# EAGLE design ledtiny85-nrf-sot23 (EAGLE 8.3.2)
DESIGNER: Willie Zhu
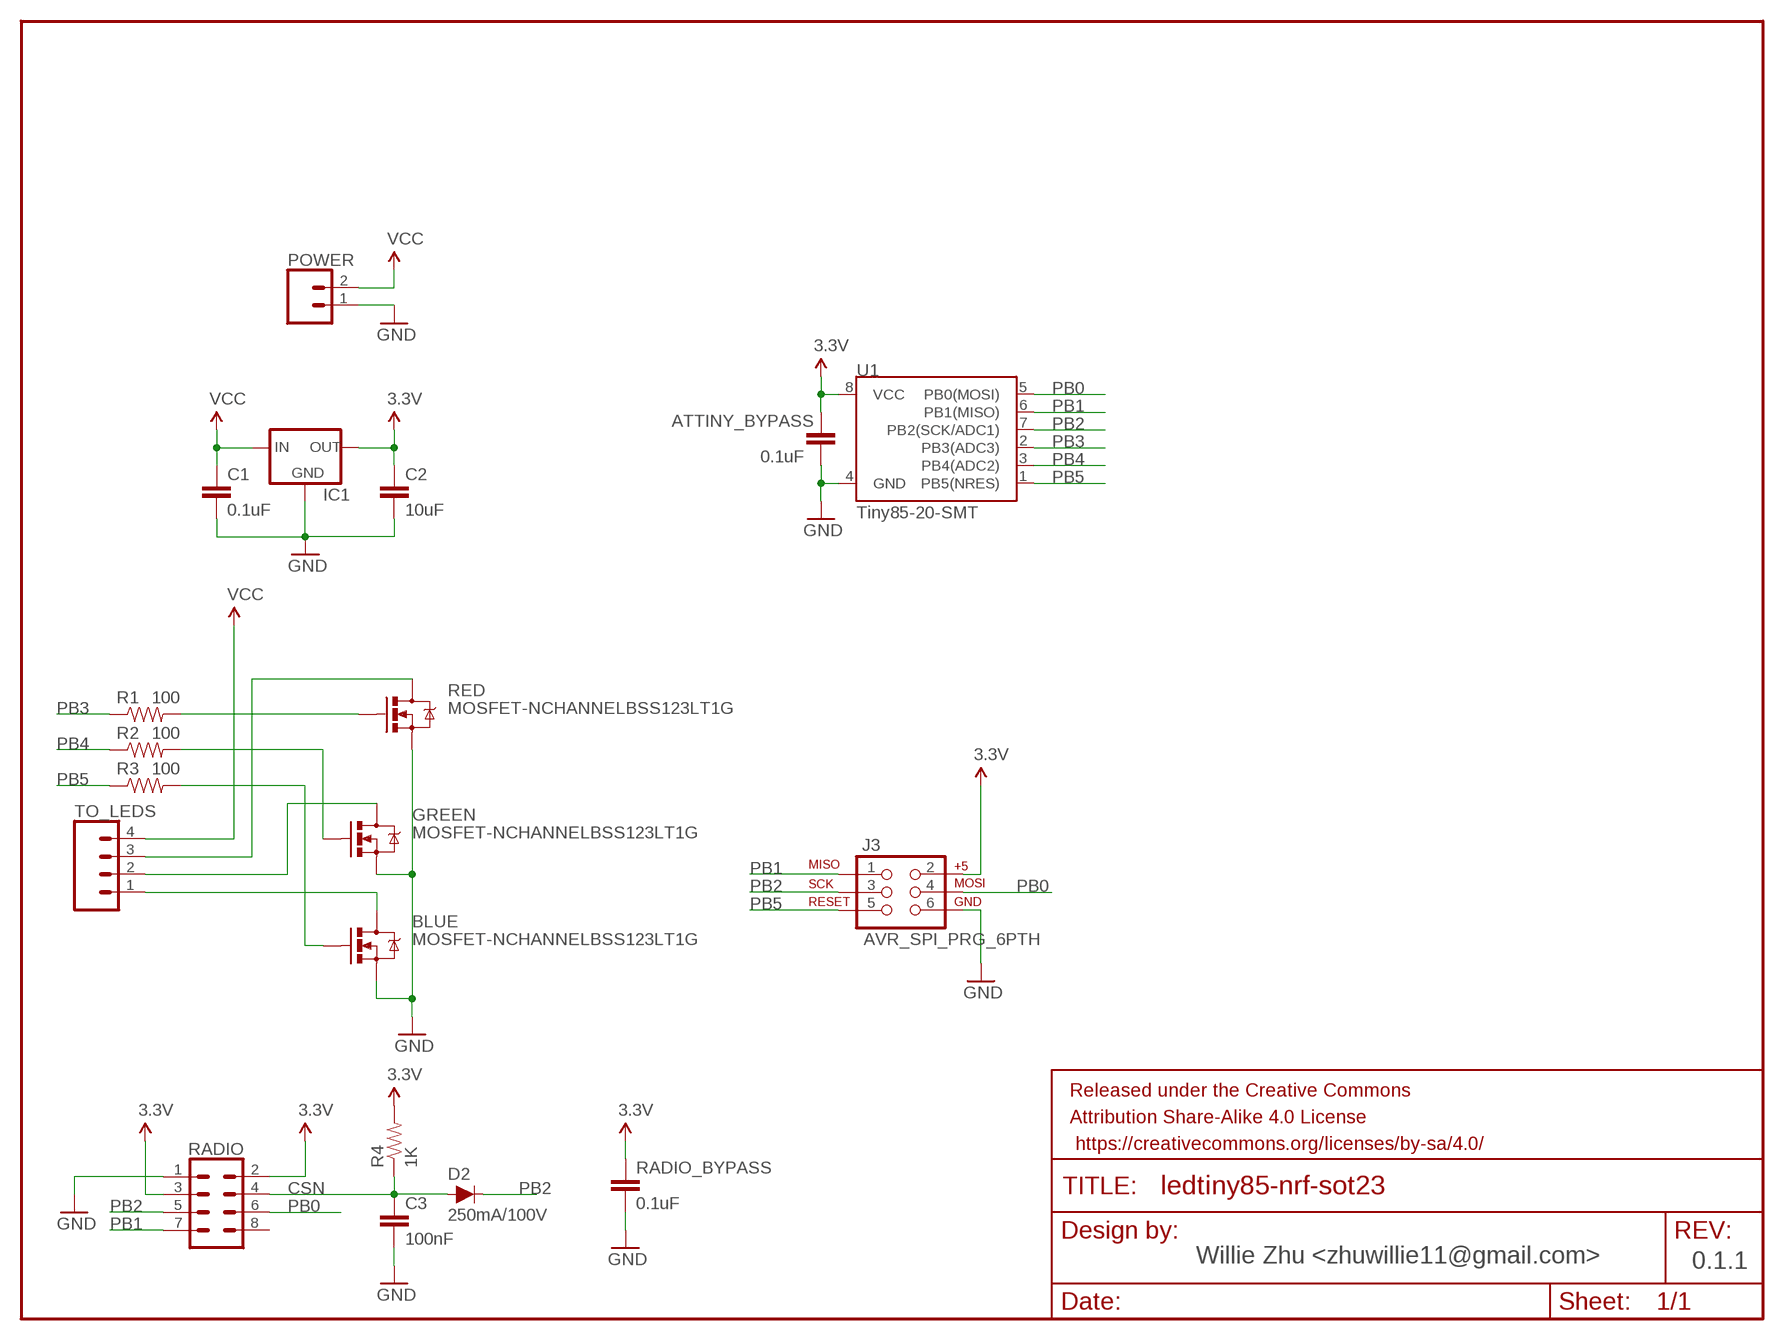
[diagram p0: schematic, sheet 1]

## Parts
ATTINY_BYPASS  0.1uF  CAP0805  [0805]
BLUE  MOSFET-NCHANNELBSS123LT1G  [SOT23-3]
C1  0.1uF  CAP0805  [0805]
C2  10uF  CAP0805  [0805]
C3  100nF  CAP0805  [0805]
D2  250mA/100V  DIODE-BAS16J  [SOD-323]
FRAME1  FRAME-LETTER  [CREATIVE_COMMONS]
GREEN  MOSFET-NCHANNELBSS123LT1G  [SOT23-3]
IC1  XC63FPM  [SOT23]
J3  AVR_SPI_PRG_6PTH  [2X3]
POWER  CONN_02  [1X02]
R1  100  RESISTOR0805  [0805]
R2  100  RESISTOR0805  [0805]
R3  100  RESISTOR0805  [0805]
R4  1K  RESISTOR0805-RES  [0805]
RADIO  CONN_04X2  [2X4]
RADIO_BYPASS  0.1uF  CAP0805  [0805]
RED  MOSFET-NCHANNELBSS123LT1G  [SOT23-3]
TO_LEDS  CONN_04  [1X04]
U1  Tiny85-20-SMT  ATTINY45TINY85-20-SMT  [SO08-EIAJ]

## Nets
3.3V: ATTINY_BYPASS.1 C2.1 IC1.2(OUT) J3.2 R4.2 RADIO.2 RADIO.3 RADIO_BYPASS.1 U1.8(VCC)
BLUE: BLUE.3(D) TO_LEDS.1
CSN: C3.1 D2.A R4.1 RADIO.4
GND: ATTINY_BYPASS.2 BLUE.2(S) C1.2 C2.2 C3.2 GREEN.2(S) IC1.1(GND) J3.6 POWER.1 RADIO.1 RADIO_BYPASS.2 RED.2(S) U1.4(GND)
GREEN: GREEN.3(D) TO_LEDS.2
N$1: R1.2 RED.1(G)
N$3: GREEN.1(G) R2.2
N$4: BLUE.1(G) R3.2
PB0: J3.4 RADIO.6 U1.5(PB0(MOSI))
PB1: J3.1 RADIO.7 U1.6(PB1(MISO))
PB2: D2.C J3.3 RADIO.5 U1.7(PB2(SCK/ADC1))
PB3: R1.1 U1.2(PB3(ADC3))
PB4: R2.1 U1.3(PB4(ADC2))
PB5: J3.5 R3.1 U1.1(PB5(NRES))
RED: RED.3(D) TO_LEDS.3
VCC: C1.1 IC1.3(IN) POWER.2 TO_LEDS.4
Unconnected: RADIO.8

## Notes on the sheet
- Willie Zhu <zhuwillie11@gmail.com> | 0.1.1

## Library data of the parts
ATTINY_BYPASS C1-C3 RADIO_BYPASS = SparkFun-Passives:CAP: Capacitor Standard 0603 ceramic capacitor, and 0.1" leaded capacitor.
BLUE GREEN RED = SparkFun-DiscreteSemi:MOSFET-NCHANNEL: Common NMOSFET Parts MFG P/N Store ID Prod ID FDD8780 TRANS-09984 SI7820DN TRANS-11055 FDS6630A IC-08089 2N7002PW TRANS-11151 FQP30N06L COM-10213 TRANS-10060 BSS123LT1G TRANS-08345 BSS138 TRANS-00830 BS170 2N7000; PROD_ID: TRANS-08345
D2 = SparkFun-DiscreteSemi:DIODE: Diode These are standard reverse protection diodes and small signal diodes. SparkFun Products: SparkFun SparkPunk Sound Kit <https://www.sparkfun.com/products/11177> SparkFun ESP8266 Thing <https://www.sparkfun.com/products/13231>; PROD_ID: DIO-09646
FRAME1 = SparkFun-Aesthetics:FRAME-LETTER: Schematic Frame Standard 8.5x11 US Letter frame
IC1 = v-reg:XC63FP: Positiv Voltage Regulators www.torex.co.jp/english/product/pro02/pdf/0201_xc62fp.pdf
J3 = SparkFun-Connectors:AVR_SPI_PRG_6: AVR ISP 6 Pin This is the reduced ISP connector for AVR programming. Common on Arduino. This footprint will take up less PCB space and can be used with a 10-pin to 6-pin adapter such as SKU: BOB-08508 **Special note about "TEST_POINT" package. The stop mask is on the top side, so if you want your programming test points to be on the bottom of your board, make sure to place this package on the bottom side of the board. This also ensure that the orientation to program from the bottom side will be correct.
POWER = SparkFun-Connectors:CONN_02: Multi connection point. Often used as Generic Header-pin footprint for 0.1 inch spaced/style header connections On any of the 0.1 inch spaced packages, you can populate with these: Break Away Headers - Straight <https://www.sparkfun.com/products/116> (PRT-00116) Break Away Male Headers - Right Angle <https://www.sparkfun.com/products/553> (PRT-00553) Female Headers <https://www.sparkfun.com/products/115> (PRT-00115) Break Away Headers - Machine Pin <https://www.sparkfun.com/products/117> (PRT-00117) Break Away Female Headers - Swiss Machine Pin <https://www.sparkfun.com/products/743> (PRT-00743) For SCREWTERMINALS and SPRING TERMINALS visit here: Screw Terimnals on SparkFun.com <https://www.sparkfun.com/search/results?term=Screw+Terminals> (5mm/3.5mm/2.54mm spacing) This device is also useful as a general connection point to wire up your design to another part of your project. Our various solder wires solder well into these plated through hole pads. Hook-Up Wire - Assortment (Stranded, 22 AWG) <https://www.sparkfun.com/products/11375> (PRT-11375) Hook-Up Wire - Assortment (Solid Core, 22 AWG) <https://www.sparkfun.com/products/11367> (PRT-11367) View the entire wire category on our website here <https://www.sparkfun.com/categories/141> Special notes: Molex polarized connector foot print use with: PRT-08233 with associated crimp pins and housings. 2.54_SCREWTERM for use with PRT-10571. 3.5mm Screw Terminal footprints for PRT-08084 5mm Screw Terminal footprints for use with PRT-08432
R1-R3 = SparkFun-Resistors:RESISTOR: Generic Resistor Package
R4 = SparkFun-Passives:RESISTOR: Resistor Basic schematic elements and footprints for 0603, 1206, and PTH resistors.
RADIO = SparkFun-Connectors:CONN_04X2: Multi connection point. Often used as Generic Header-pin footprint for 0.1 inch spaced/style header connections On any of the 0.1 inch spaced packages, you can populate with these: Break Away Headers - Straight <https://www.sparkfun.com/products/116> (PRT-00116) Break Away Male Headers - Right Angle <https://www.sparkfun.com/products/553> (PRT-00553) Female Headers <https://www.sparkfun.com/products/115> (PRT-00115) Break Away Headers - Machine Pin <https://www.sparkfun.com/products/117> (PRT-00117) Break Away Female Headers - Swiss Machine Pin <https://www.sparkfun.com/products/743> (PRT-00743)
TO_LEDS = SparkFun-Connectors:CONN_04: Multi connection point. Often used as Generic Header-pin footprint for 0.1 inch spaced/style header connections On any of the 0.1 inch spaced packages, you can populate with these: Break Away Headers - Straight <https://www.sparkfun.com/products/116> (PRT-00116) Break Away Male Headers - Right Angle <https://www.sparkfun.com/products/553> (PRT-00553) Female Headers <https://www.sparkfun.com/products/115> (PRT-00115) Break Away Headers - Machine Pin <https://www.sparkfun.com/products/117> (PRT-00117) Break Away Female Headers - Swiss Machine Pin <https://www.sparkfun.com/products/743> (PRT-00743) For SCREWTERMINALS and SPRING TERMINALS visit here: Screw Terimnals on SparkFun.com <https://www.sparkfun.com/search/results?term=Screw+Terminals> (5mm/3.5mm/2.54mm spacing) This device is also useful as a general connection point to wire up your design to another part of your project. Our various solder wires solder well into these plated through hole pads. Hook-Up Wire - Assortment (Stranded, 22 AWG) <https://www.sparkfun.com/products/11375> (PRT-11375) Hook-Up Wire - Assortment (Solid Core, 22 AWG) <https://www.sparkfun.com/products/11367> (PRT-11367) View the entire wire category on our website here <https://www.sparkfun.com/categories/141> Special notes: Molex polarized connector foot print use with SKU : PRT-08231 with associated crimp pins and housings. 1MM SMD Version SKU: PRT-10208; PROD_ID: CONN-09696
U1 = SparkFun-DigitalIC:ATTINY45: Atmel 8-pin 2/4/8kB flash uC; PROD_ID: IC-09092

## Board
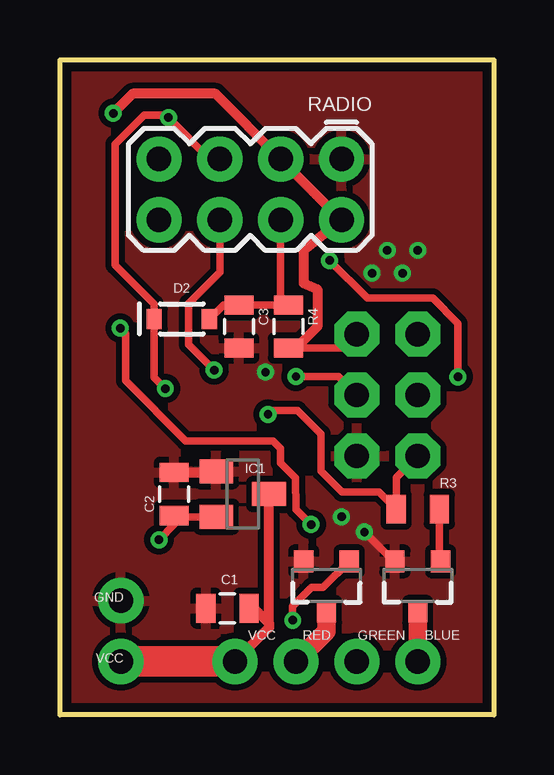
[diagram p1: board, top side]
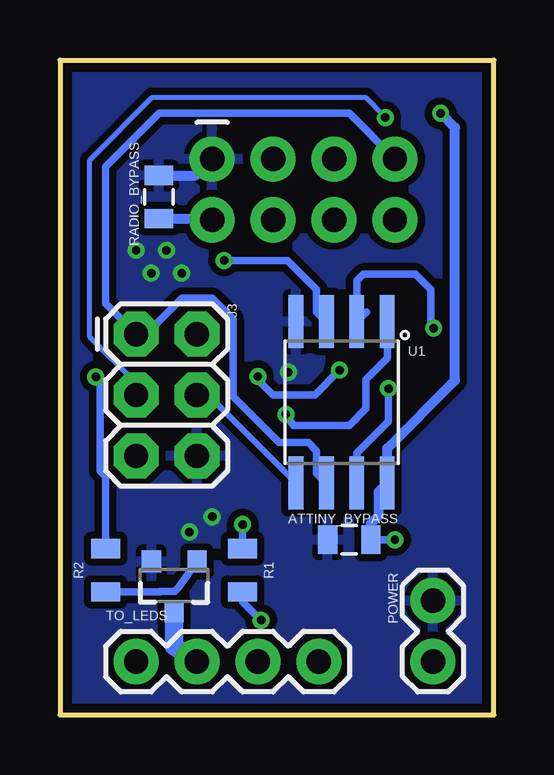
[diagram p2: board, bottom side, seen from below]

Size 18.1 x 27.3 mm. Coordinates in mm from the lower left corner, seen from the top.
Outline: 18.1,0 0,0 0,27.3 18.1,27.3 18.1,0
Copper layers (1*16): Top 0.0356mm / dielectric 1.5011mm / Bottom 0.0356mm
Design rules "LaenPCBOrder": minimum track width 6mil, minimum drill 13mil, track to track 6mil, track to pad 6mil, pad to pad 6mil, via to via 6mil, smd to smd 6mil, copper to edge 15mil, drill to drill 6mil, minimum pad ring 7mil, minimum via ring 7mil, stop-mask expansion 3mil, vias tented up to drill 0mil, thermal gap 10mil

### Footprints (pad centres in the part's own frame; a part is rotated, then mirrored left to right if it is on the bottom)
0805 = smd 0.8 x 1.2: 1 -0.9,0; 2 0.9,0
SOT23-3 = smd 0.8 x 0.9: 1 -0.95,-1; 2 0.95,-1; 3 0,1.1
SOD-323 = smd 0.63 x 0.83: A 1.15,0; C -1.15,0
SOT23 = smd 1 x 1.4: 1 -0.95,-1.1; 2 0.95,-1.1; 3 0,1.1
2X3 = drill 1.016 pad 1.88 octagon: 1 0,0; 2 0,2.54; 3 2.54,0; 4 2.54,2.54; 5 5.08,0; 6 5.08,2.54
1X02 = drill 1.016 pad 1.88: 1 0,0; 2 2.54,0
2X4 = drill 1.016 pad 1.88: 1 -3.81,-1.27; 2 -3.81,1.27; 3 -1.27,-1.27; 4 -1.27,1.27; 5 1.27,-1.27; 6 1.27,1.27; 7 3.81,-1.27; 8 3.81,1.27
1X04 = drill 1.016 pad 1.88: 1 0,0; 2 2.54,0; 3 5.08,0; 4 7.62,0
SO08-EIAJ = smd 0.61 x 2.21: 1 -1.905,-3.378; 2 -0.635,-3.378; 3 0.635,-3.378; 4 1.905,-3.378; 5 1.905,3.353; 6 0.635,3.353; 7 -0.635,3.353; 8 -1.905,3.353

### Placement (x,y rotation side)
ATTINY_BYPASS  6.03,7.3 180 bottom
BLUE  14.92,5.4 180 top
C1  6.99,4.45 180 top
C2  4.76,9.21 90 top
C3  7.46,16.19 270 top
D2  5.08,16.51 0 top
FRAME1  15.24,-13.97 0 top  (outside the outline)
GREEN  13.34,5.4 180 bottom
IC1  7.62,9.21 270 top
J3  14.92,15.88 270 bottom
POWER  2.54,4.76 270 bottom
R1  10.48,6.03 270 bottom
R2  16.19,6.03 270 bottom
R3  14.92,8.57 0 top
R4  9.53,16.19 270 top
RADIO  7.94,21.91 180 top
RADIO_BYPASS  13.97,21.59 90 bottom
RED  11.11,5.4 180 top
TO_LEDS  14.92,2.22 0 bottom
U1  6.35,13.02 180 bottom

### Tracks (layer width: path | path; a pad name or v marks a point on that pad's centre or on a via)
3.3V  (via drill 0.35)
  Top 0.305: R4.2 9.84,15.29 11.8,15.29 J3.2 | v4.13,7.3 4.76,7.94 C2.1 4.81,8.26 IC1.2
  Top 0.406: v2.22,25.08 3.03,25.89 6.5,25.89 RADIO.3 RADIO.2 10.16,19.37 10.16,18 10.73,17.75 10.73,16.18 9.84,15.29
  Bottom 0.305: v4.13,7.3 ATTINY_BYPASS.1
  Bottom 0.406: ATTINY_BYPASS.1 5.13,7.97 4.8,8.31 4.8,9.31 U1.8 4.45,11.11 1.63,13.93 1.63,24.49 v2.22,25.08 | RADIO_BYPASS.1 12.12,20.69 RADIO.2
BLUE
  Top 0.762: BLUE.3 TO_LEDS.1
CSN
  Top 0.305: RADIO.4 9.21,17.46 R4.1 C3.1 6.81,17.09 D2.A
GND  (via drill 0.35)
  Top 0.305: BLUE.2 13.92,6.4 v12.7,7.62
  Top 0.406: 4.5,10.16 C2.2 6.47,10.11 IC1.1
  Bottom 0.406: RADIO_BYPASS.2 12.44,22.49 RADIO.1
  other vias: 14.92,19.37 11.75,8.26 8.57,14.29 13.65,19.37 14.29,18.41 13.02,18.41
  pour Top (isolate 0.254): 41.59,39.69 41.59,-2.22 -0.32,-2.22 -0.32,39.69
  pour Bottom (isolate 0.305): -1.59,40.96 42.86,40.96 42.86,-3.49 -1.59,-3.49
GREEN
  Bottom 0.762: GREEN.3 13.34,2.86 TO_LEDS.2
N$1  (via drill 0.35)
  Top 0.305: RED.1 10.97,5.31 10.48,5.31 9.71,4.53 v9.71,3.95
  Bottom 0.305: R1.2 10.48,4.72 v9.71,3.95
N$3
  Bottom 0.305: GREEN.1 13.16,5.31 13.31,5.15 13.9,5.15 13.93,5.13 R2.2
N$4
  Top 0.305: R3.2 15.82,6.45 BLUE.1
PB0  (via drill 0.35)
  Top 0.305: J3.4 11.61,14.11 v9.84,14.11 | RADIO.6 6.67,18.47 5.36,17.16 5.36,15.45 v6.43,14.37
  Bottom 0.254: J3.4 11.93,13.34 U1.5
  Bottom 0.305: v6.43,14.37 7.47,13.34 9.21,13.34 9.84,13.97 v9.84,14.11
PB1
  Bottom 0.305: RADIO.7 6.03,25.08 13.97,25.08 16.19,22.86 16.19,17.14 J3.1 14.5,15.88 13,17.37 11.76,17.37 10.88,16.5 10.88,13.26 8.97,11.35 7.74,11.35 7.39,11 7.39,10.07 U1.6
PB2  (via drill 0.35)
  Top 0.305: RADIO.5 6.25,23.18 v4.53,24.9 4.43,24.99 3.51,24.99 2.31,23.8 2.31,18.75 3.93,17.13 D2.C 3.93,14.07 v4.4,13.6
  Bottom 0.203: J3.3 14.92,13.83 16.85,15.76 16.85,23.13 14.24,25.74 5.37,25.74 v4.53,24.9
  Bottom 0.305: v4.4,13.6 4.4,12.24 5.71,10.92 U1.7
PB3  (via drill 0.35)
  Top 0.305: v2.51,16.12 2.74,15.89 2.74,13.94 5.24,11.43 8.89,11.43 9.21,11.11 9.21,10.5 9.83,9.88 9.84,8.57 v10.48,7.94
  Bottom 0.305: R1.1 v10.48,7.94 | v2.51,16.12 2.63,16.24 2.63,17.73 3.27,18.38 5.44,18.38 5.71,18.1 U1.2 5.31,16.8
PB4  (via drill 0.35)
  Top 0.305: v16.6,14.09 16.6,16.32 15.54,17.37 12.82,17.37 v11.25,18.95
  Bottom 0.305: R2.1 16.19,9.95 16.42,10.17 16.42,13.91 v16.6,14.09 | U1.3 7.39,16.8 7.39,17.73 8.61,18.95 v11.25,18.95
PB5  (via drill 0.35)
  Top 0.305: J3.5 14.02,9.89 R3.1 13.3,9.3 11.76,9.3 10.88,10.17 10.88,11.71 9.91,12.68 8.83,12.68 v8.68,12.53
  Bottom 0.305: U1.1 4.45,14.88 5.33,13.99 5.33,12.77 6.03,12.07 8.36,12.07 v8.68,12.53
RED
  Top 0.762: RED.3 11.11,3.49 TO_LEDS.3
VCC
  Top 0.406: 8.72,3.81 IC1.3 | 8.72,3.81 8.72,3.64 TO_LEDS.4 | C1.1 8.09,4.45 8.72,3.81
  Top 1.27: TO_LEDS.4 POWER.2

### Text on the board
tNames: GND | VCC | GREEN | VCC
tDocu: Willie Zhu